# EAGLE design lipo-max1811 (EAGLE 6.1)
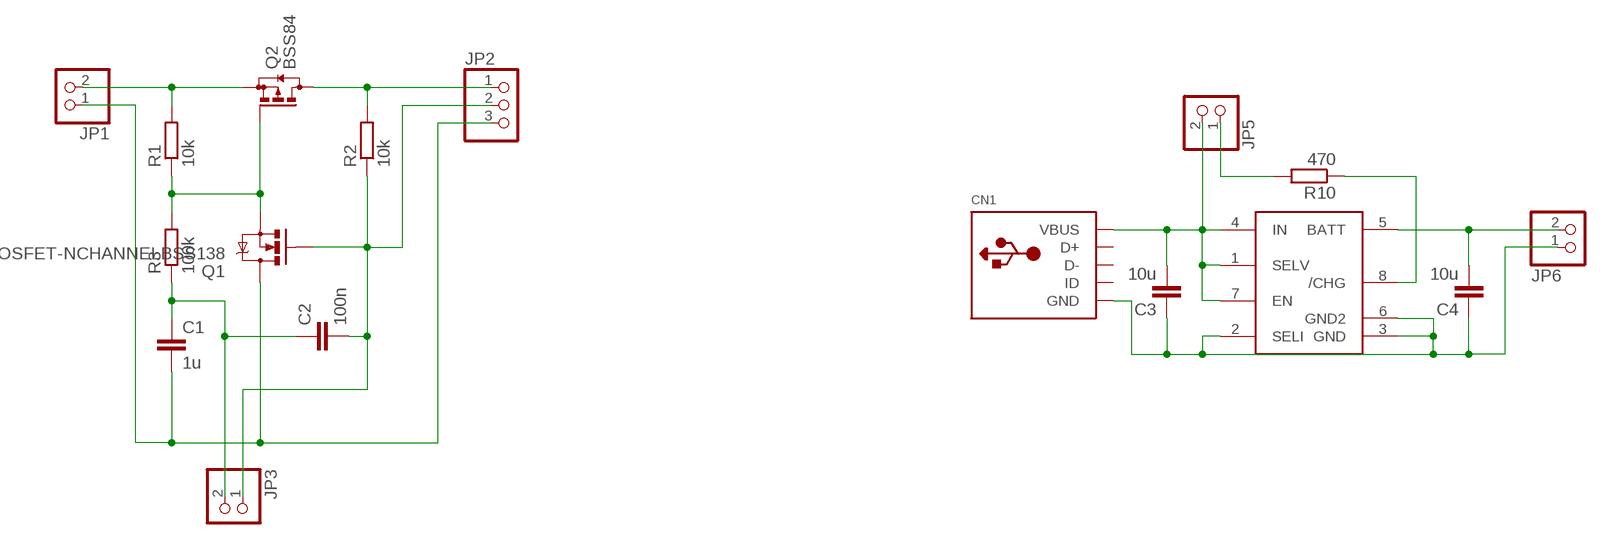
[diagram p0: schematic, sheet 1]

## Parts
C1  1u  C-EUC0805K  [C0805K]
C2  100n  C-EUC0805K  [C0805K]
C3  10u  C-EUC0805K  [C0805K]
C4  10u  C-EUC0805K  [C0805K]
CN1  USBTHM  [USB-MINIB-THM]
JP1  PINHD-1X2  [1X02]
JP2  PINHD-1X3  [1X03]
JP3  PINHD-1X2  [1X02]
JP5  PINHD-1X2  [1X02]
JP6  PINHD-1X2  [1X02]
Q1  MOSFET-NCHANNELBSS138  [SOT23]
Q2  BSS84  [SOT23]
R1  10k  R-EU_R0805  [R0805]
R2  10k  R-EU_M0805  [M0805]
R3  100k  R-EU_R0805  [R0805]
R10  470  R-EU_M0805  [M0805]
U$1  MAX1811SO8  [SO08]

## Nets
BAT+: JP1.2 Q2.2(S) R1.2
GND: C1.2 JP1.1 JP2.3 Q1.3(D)
N$1: C3.2 CN1.VBUS JP5.2 U$1.1(SELV) U$1.4(IN) U$1.7(EN)
N$2: C3.1 C4.1 CN1.GND JP6.1 U$1.2(SELI) U$1.3(GND) U$1.6(GND2)
N$3: Q1.2(S) Q2.1(G) R1.1 R3.2
N$4: C1.1 C2.1 JP3.2 R3.1
N$5: R10.1 U$1.8(/CHG)
N$6: C2.2 JP2.2 JP3.1 Q1.1(G) R2.1
N$7: JP5.1 R10.2
N$8: C4.2 JP6.2 U$1.5(BATT)
VCC: JP2.1 Q2.3(D) R2.2
Unconnected: CN1.D+ CN1.D- CN1.ID

## Library data of the parts
C1-C4 = rcl:C-EU: CAPACITOR, European symbol
CN1 = adafruit:USB: USB Connectors USBMINIB - Surface Mount Female Mini-B USB Connector 4UConnector: 06564 By microbuilder.eu Thru-hole RA Female Mini-B USB Connector 4UConnector: 18732 By ladyada.net
JP1 JP3 JP5 JP6 = pinhead:PINHD-1X2: PIN HEADER
JP2 = pinhead:PINHD-1X3: PIN HEADER
Q1 = SparkFun-DiscreteSemi:MOSFET-NCHANNEL: Common NMOSFET Parts MFG P/N Store ID Prod ID FDD8780 TRANS-09984 SI7820DN TRANS-11055 FDS6630A IC-08089 2N7002PW TRANS-11151 FQP30N06L COM-10213 TRANS-10060 BSS123LT1G TRANS-08345 BSS138 TRANS-00830 BS170 2N7000; PROD_ID: TRANS-00830
Q2 = transistor-small-signal:BSS84: P-CHANNEL MOS FET
R1-R3 R10 = rcl:R-EU_: RESISTOR, European symbol
U$1 = adafruit:MAX1811: Maxim MAX1811 USB li-ion battery charger http://www.ladyada.net/library/eagle

## Board
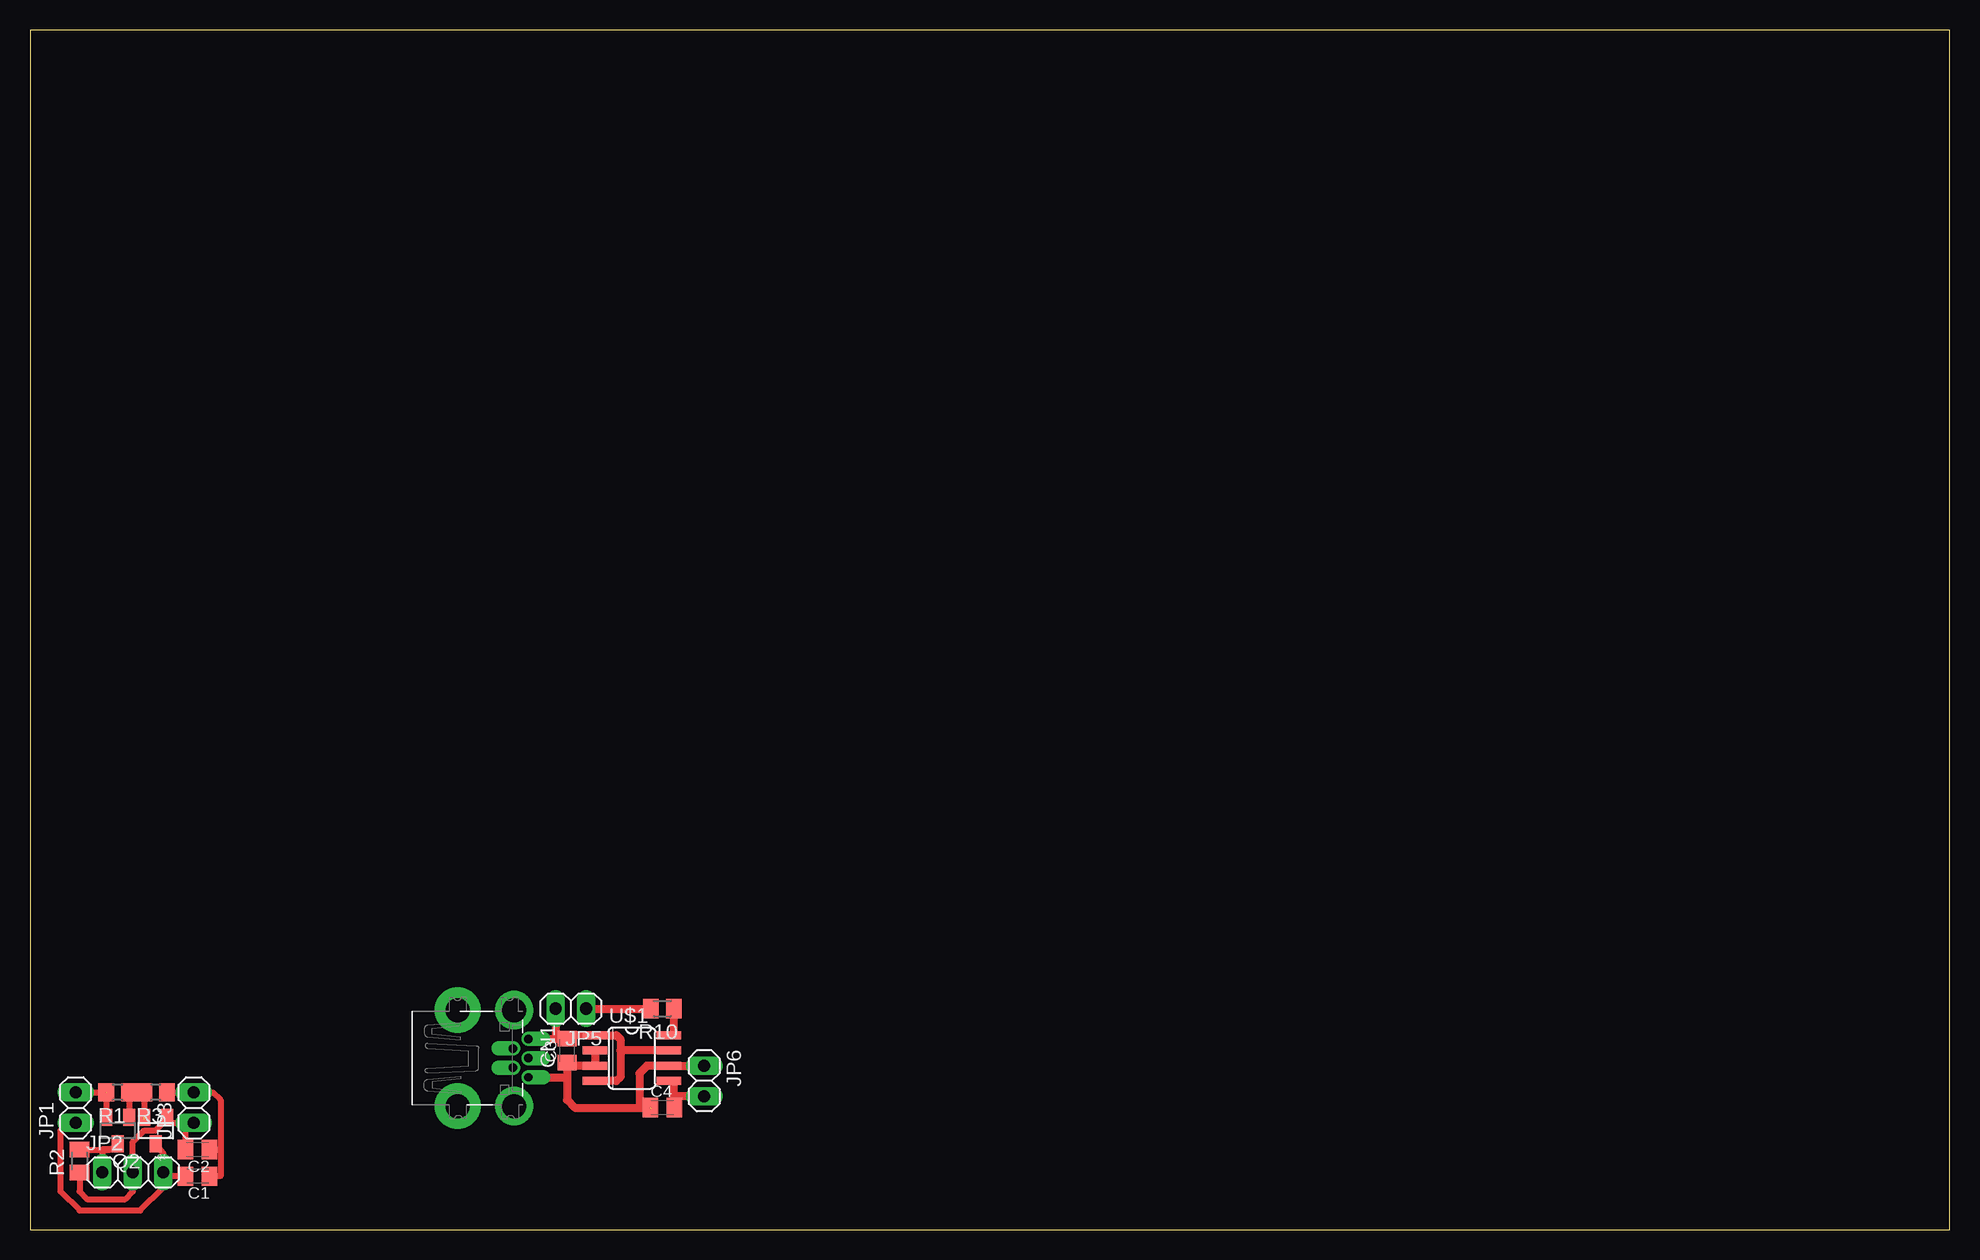
[diagram p1: board, top side]

Size 160 x 100 mm. Coordinates in mm from the lower left corner, seen from the top.
Outline: 0,0 160,0 160,100 0,100 0,0
Copper layers (1*16): Top 0.035mm / dielectric 1.5mm / Bottom 0.035mm
Design rules: minimum track width 10mil, minimum drill 24mil, track to track 8mil, track to pad 8mil, pad to pad 8mil, via to via 8mil, smd to smd 8mil, copper to edge 40mil, drill to drill 8mil, minimum pad ring 10mil, minimum via ring 8mil, stop-mask expansion 4mil, vias tented up to drill 0mil, thermal gap 10mil

### Footprints (pad centres in the part's own frame; a part is rotated, then mirrored left to right if it is on the bottom)
C0805K = smd 1.3 x 1.6: 1 -1,0; 2 1,0
USB-MINIB-THM = drill 0.7 offset: D+ 0,9.8; D- -0.8,8.5; GND 1.6,9.8; ID 0.8,8.5; VBUS -1.6,9.8 | drill 2 pad 3.81: GND1 -4,3.9; GND4 4,3.9 | drill 2 pad 3.2: GND2 -4,8.6; GND3 4,8.6
1X02 = drill 1.016 long: 1 -1.27,0; 2 1.27,0
1X03 = drill 1.016 long: 1 -2.54,0; 2 0,0; 3 2.54,0
SOT23 = smd 1 x 1.4: 1 -0.95,-1.1; 2 0.95,-1.1; 3 0,1.1
R0805 = smd 1.3 x 1.5: 1 -0.95,0; 2 0.95,0
M0805 = smd 1.3 x 1.6: 1 -0.95,0; 2 0.95,0
SO08 = smd 0.66 x 2.032: 1 -1.905,-3.073; 2 -0.635,-3.073; 3 0.635,-3.073; 4 1.905,-3.073; 5 1.905,3.073; 6 0.635,3.073; 7 -0.635,3.073; 8 -1.905,3.073

### Placement (x,y rotation side)
C1  13.97,4.45 180 top
C2  13.97,6.67 180 top
C3  44.77,14.92 90 top
C4  52.7,10.16 0 top
CN1  31.75,14.29 270 top
JP1  3.81,10.16 90 top
JP2  8.57,4.76 0 top
JP3  13.65,10.16 90 top
JP5  45.09,18.41 180 top
JP6  56.2,12.38 270 top
Q1  10.48,8.26 180 top
Q2  7.3,8.26 180 top
R1  7.3,11.43 180 top
R2  4.13,5.71 90 top
R3  10.48,11.43 180 top
R10  52.7,18.41 180 top
U$1  50.16,14.29 270 top

### Tracks (layer width: path | path; a pad name or v marks a point on that pad's centre or on a via)
BAT+  (1 unrouted)
  Top 0.508: JP1.2 R1.2 | R1.2 Q2.2
GND
  Top 0.508: JP1.1 3.17,8.89 2.54,8.26 2.54,3.17 4.13,1.59 9.21,1.59 11.11,3.49 11.11,4.45 | Q1.3 11.11,6.35 JP2.3 11.11,4.45 | C1.2 11.11,4.45
N$1
  Top 0.66: CN1.VBUS 43.81,15.89 | 43.81,15.89 44.77,15.89 C3.2 44.81,15.88 45.09,15.88 45.4,16.19 U$1.1 48.9,16.19 49.21,15.88 49.21,14.92 | JP5.2 43.81,15.89 | 49.21,14.92 49.21,12.7 48.9,12.38 U$1.4 | U$1.7 49.21,14.92
N$2  (1 unrouted)
  Top 0.66: U$1.2 U$1.3 45.04,13.65 C3.1 44.77,12.7 | 44.77,12.7 44.77,10.79 45.4,10.16 50.8,10.16 | 50.8,10.16 51.75,10.16 | CN1.GND 44.76,12.69 44.77,12.7 | 50.8,10.16 50.8,13.02 51.44,13.65 U$1.6 JP6.1
N$3  (1 unrouted)
  Top 0.508: Q2.1 R1.1 R3.2 | R3.2 | R3.2 9.53,9.21
N$4
  Top 0.508: R3.1 JP3.2 15.24,11.43 15.88,10.79 15.88,6.67 | 15.88,6.67 15.88,4.45 C1.1 | C2.1 15.88,6.67
N$5
  Top 0.66: R10.1 53.66,16.19 U$1.8
N$6
  Top 0.508: R2.1 4.13,3.17 4.76,2.54 7.94,2.54 8.57,3.17 JP2.2 8.57,7.3 9.53,8.26 10.48,8.26 11.11,8.89 11.43,8.89 | 11.6,9.36 Q1.1 11.43,8.89 | 13.02,8.89 JP3.1 | C2.2 12.97,8.84 13.02,8.89 | 11.43,8.89 13.02,8.89
N$7
  Top 0.66: JP5.1 R10.2
N$8
  Top 0.66: C4.2 53.7,11.11 | 53.7,11.11 53.7,12.38 U$1.5 | JP6.2 53.7,11.11
VCC
  Top 0.508: R2.2 6.67,6.67 6.03,6.67 | Q2.3 6.82,6.67 6.03,6.67 | 6.03,6.67 JP2.1